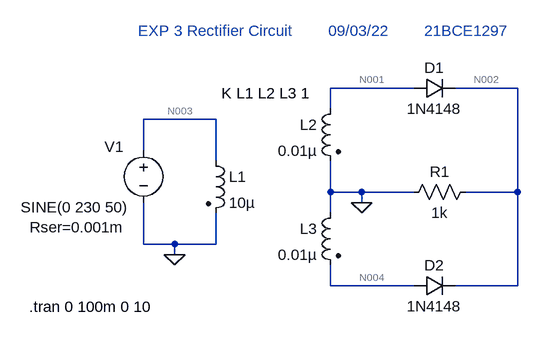
[diagram p0: schematic Exp3_Part3.asc]
Exp3_Part3.asc, the LTspice schematic file:
Version 4
SHEET 1 880 680
WIRE -352 176 -480 176
WIRE -192 176 -288 176
WIRE -480 208 -480 176
WIRE -656 224 -768 224
WIRE -768 272 -768 224
WIRE -656 288 -656 224
WIRE -480 336 -480 288
WIRE -432 336 -480 336
WIRE -352 336 -432 336
WIRE -192 336 -192 176
WIRE -192 336 -272 336
WIRE -432 352 -432 336
WIRE -480 368 -480 336
WIRE -768 416 -768 352
WIRE -720 416 -768 416
WIRE -656 416 -656 368
WIRE -656 416 -720 416
WIRE -720 432 -720 416
WIRE -480 480 -480 448
WIRE -352 480 -480 480
WIRE -192 480 -192 336
WIRE -192 480 -288 480
FLAG -720 432 0
FLAG -432 352 0
SYMBOL voltage -768 256 R0
WINDOW 0 -60 10 Left 2
WINDOW 3 -189 103 Left 2
WINDOW 123 0 0 Left 0
WINDOW 39 -175 134 Left 2
SYMATTR InstName V1
SYMATTR Value SINE(0 230 50)
SYMATTR SpiceLine Rser=0.001m
SYMBOL ind2 -672 272 R0
SYMATTR InstName L1
SYMATTR Value 10µ
SYMATTR Type ind
SYMBOL ind2 -464 192 M0
SYMATTR InstName L2
SYMATTR Value 0.01µ
SYMATTR Type ind
SYMBOL diode -352 192 R270
WINDOW 0 32 32 VTop 2
WINDOW 3 0 32 VBottom 2
SYMATTR InstName D1
SYMATTR Value 1N4148
SYMBOL ind2 -464 352 M0
SYMATTR InstName L3
SYMATTR Value 0.01µ
SYMATTR Type ind
SYMBOL diode -352 496 R270
WINDOW 0 32 32 VTop 2
WINDOW 3 0 32 VBottom 2
SYMATTR InstName D2
SYMATTR Value 1N4148
SYMBOL res -256 320 R90
WINDOW 0 0 56 VBottom 2
WINDOW 3 32 56 VTop 2
SYMATTR InstName R1
SYMATTR Value 1k
TEXT -776 88 Left 2 ;EXP 3 Rectifier Circuit        09/03/22        21BCE1297
TEXT -648 184 Left 2 !K L1 L2 L3 1
TEXT -944 512 Left 2 !.tran 0 100m 0 10

The netlist it stands for:
* Exp3_Part3.asc
V1 N003 0 SINE(0 230 50) Rser=0.001m
L1 N003 0 10µ
L2 N001 0 0.01µ
D1 N001 N002 1N4148
L3 0 N004 0.01µ
D2 N004 N002 1N4148
R1 N002 0 1k
.model D D
.lib standard.dio
* EXP 3 Rectifier Circuit        09/03/22        21BCE1297
K L1 L2 L3 1
.tran 0 100m 0 10
.backanno
.end

* Results of the author's LTspice run, read from the files saved beside the schematic
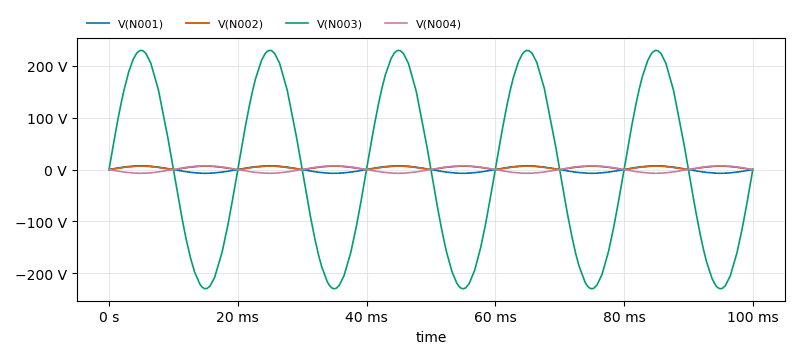
[diagram p1: Transient Analysis of Exp3_Part3.asc, plotted from the saved traces]
* Transient Analysis, 1 run:
*   V(N001): min -7.257 V, max 7.25 V, average -18.51 mV, rms 5.084 V, last 75.71 µV
*   V(N002): min 0 V, max 6.584 V, average 3.935 V, rms 4.505 V, last 3.788 µV
*   V(N003): min -230.1 V, max 229.9 V, average -239.5 mV, rms 162.7 V, last 2.394 mV
*   V(N004): min -7.25 V, max 7.257 V, average 18.51 mV, rms 5.084 V, last -75.71 µV